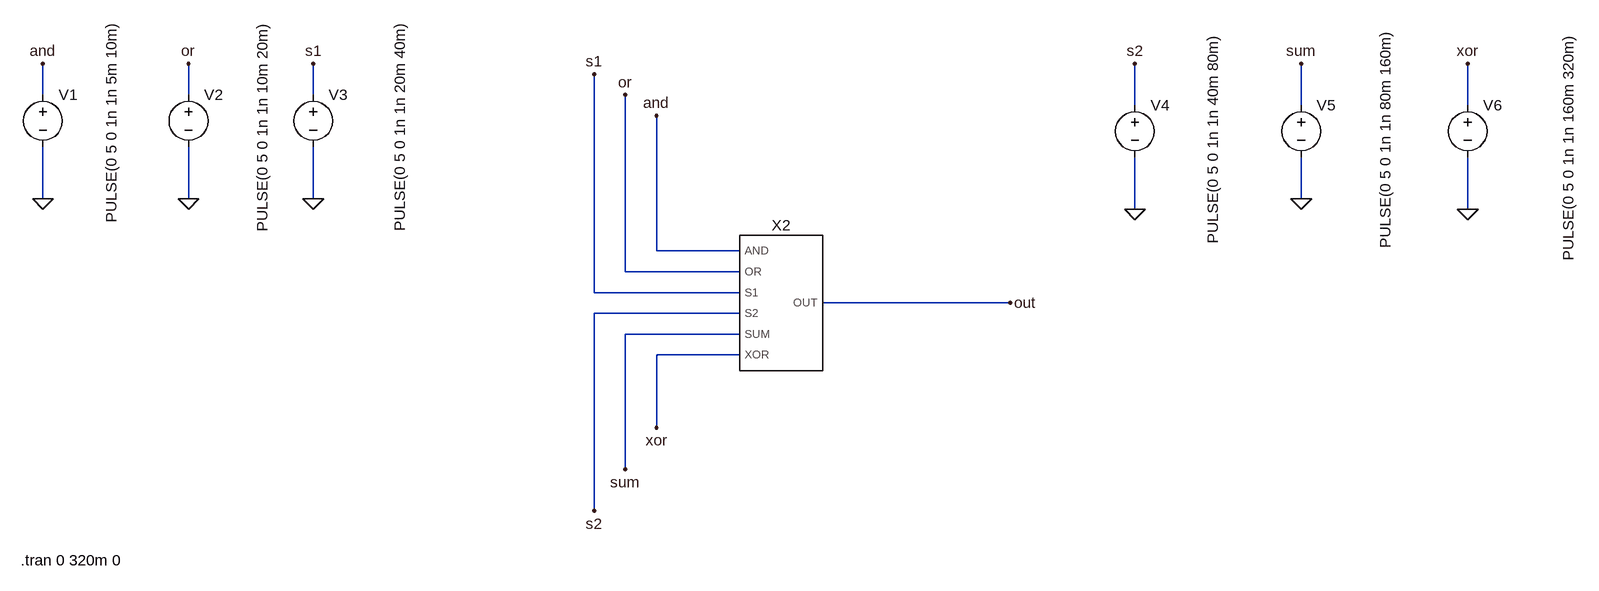
[diagram p0: schematic 4_1_mux_tb.asc]
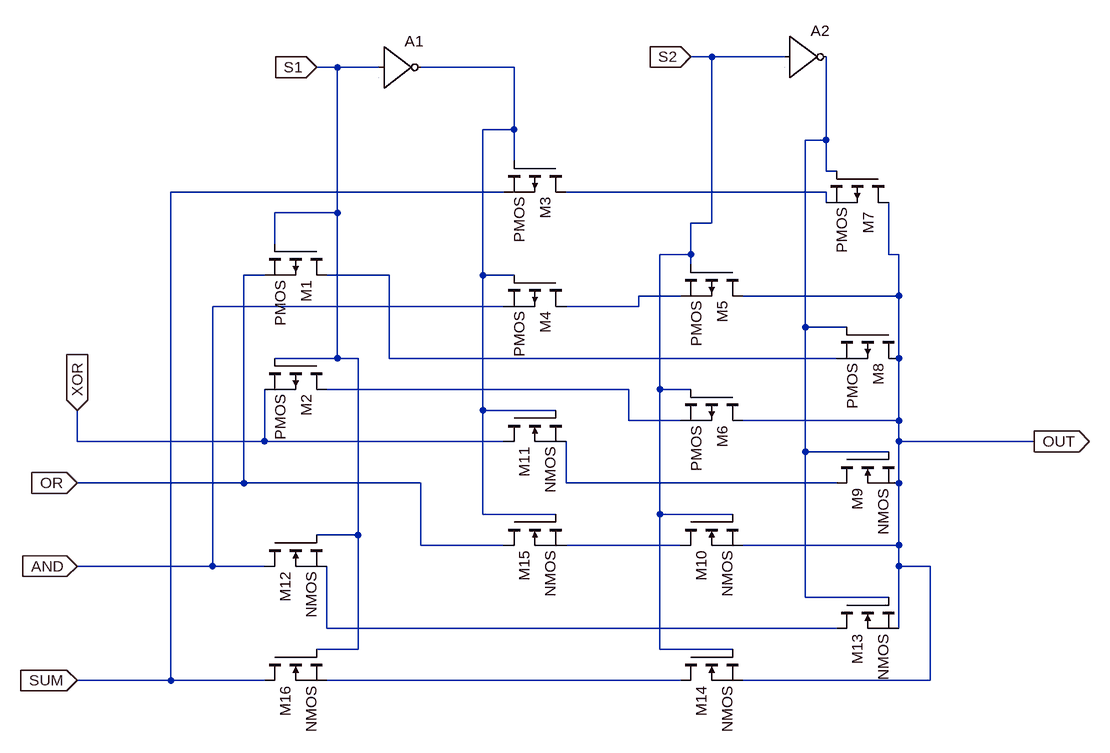
[diagram p1: sub-circuit 4_1_mux.asc]
4_1_mux_tb.asc, the LTspice schematic file:
Version 4
SHEET 1 1692 680
WIRE -912 -128 -912 -176
WIRE -688 -128 -688 -176
WIRE -496 -128 -496 -176
WIRE 768 -112 768 -176
WIRE 1024 -112 1024 -176
WIRE 1280 -112 1280 -176
WIRE -912 32 -912 -48
WIRE -688 32 -688 -48
WIRE -496 32 -496 -48
WIRE 1024 32 1024 -32
WIRE 768 48 768 -32
WIRE 1280 48 1280 -32
WIRE 32 112 32 -96
WIRE 160 112 32 112
WIRE -16 144 -16 -128
WIRE 160 144 -16 144
WIRE -64 176 -64 -160
WIRE 160 176 -64 176
WIRE 576 192 288 192
WIRE 160 208 -64 208
WIRE 160 240 -16 240
WIRE 160 272 32 272
WIRE 32 384 32 272
WIRE -16 448 -16 240
WIRE -64 512 -64 208
FLAG 32 -96 and
FLAG -912 -176 and
FLAG -16 -128 or
FLAG -688 -176 or
FLAG -64 -160 s1
FLAG -496 -176 s1
FLAG -64 512 s2
FLAG 768 -176 s2
FLAG -16 448 sum
FLAG 1024 -176 sum
FLAG 32 384 xor
FLAG 1280 -176 xor
FLAG 576 192 out
FLAG 768 48 0
FLAG 1024 32 0
FLAG 1280 48 0
FLAG -496 32 0
FLAG -688 32 0
FLAG -912 32 0
SYMBOL voltage -912 -144 R0
WINDOW 3 105 -97 VRight 2
WINDOW 123 0 0 Left 0
WINDOW 39 0 0 Left 0
SYMATTR InstName V1
SYMATTR Value PULSE(0 5 0 1n 1n 5m 10m)
SYMBOL voltage -688 -144 R0
WINDOW 3 114 -97 VRight 2
WINDOW 123 0 0 Left 0
WINDOW 39 0 0 Left 0
SYMATTR InstName V2
SYMATTR Value PULSE(0 5 0 1n 1n 10m 20m)
SYMBOL voltage -496 -144 R0
WINDOW 3 133 -98 VRight 2
WINDOW 123 0 0 Left 0
WINDOW 39 0 0 Left 0
SYMATTR InstName V3
SYMATTR Value PULSE(0 5 0 1n 1n 20m 40m)
SYMBOL voltage 768 -128 R0
WINDOW 3 120 -95 VRight 2
WINDOW 123 0 0 Left 0
WINDOW 39 0 0 Left 0
SYMATTR InstName V4
SYMATTR Value PULSE(0 5 0 1n 1n 40m 80m)
SYMBOL voltage 1024 -128 R0
WINDOW 3 129 -101 VRight 2
WINDOW 123 0 0 Left 0
WINDOW 39 0 0 Left 0
SYMATTR InstName V5
SYMATTR Value PULSE(0 5 0 1n 1n 80m 160m)
SYMBOL voltage 1280 -128 R0
WINDOW 3 155 -96 VRight 2
WINDOW 123 0 0 Left 0
WINDOW 39 0 0 Left 0
SYMATTR InstName V6
SYMATTR Value PULSE(0 5 0 1n 1n 160m 320m)
SYMBOL 4_1_mux 224 192 R0
SYMATTR InstName X2
TEXT -946 588 Left 2 !.tran 0 320m 0

4_1_mux.asc, the sub-circuit schematic file:
Version 4
SHEET 1 924 820
WIRE 320 -224 288 -224
WIRE 432 -224 320 -224
WIRE -256 -208 -288 -208
WIRE -192 -208 -256 -208
WIRE 16 -208 -128 -208
WIRE 16 -112 16 -208
WIRE 16 -112 -32 -112
WIRE 496 -96 496 -224
WIRE 496 -96 464 -96
WIRE 16 -64 16 -112
WIRE 496 -48 496 -96
WIRE 512 -48 496 -48
WIRE 0 -16 -512 -16
WIRE 496 -16 96 -16
WIRE 496 0 496 -16
WIRE -256 16 -256 -208
WIRE -256 16 -352 16
WIRE 320 32 320 -224
WIRE 320 32 288 32
WIRE -352 64 -352 16
WIRE 288 80 288 32
WIRE 288 80 240 80
WIRE 592 80 592 0
WIRE 608 80 592 80
WIRE 288 96 288 80
WIRE -368 112 -400 112
WIRE -176 112 -272 112
WIRE -32 112 -32 -112
WIRE 16 112 -32 112
WIRE 272 144 208 144
WIRE 608 144 608 80
WIRE 608 144 368 144
WIRE 0 160 -448 160
WIRE 208 160 208 144
WIRE 208 160 96 160
WIRE 464 192 464 -96
WIRE 528 192 464 192
WIRE -256 240 -256 16
WIRE -256 240 -352 240
WIRE -224 240 -256 240
WIRE -176 240 -176 112
WIRE 512 240 -176 240
WIRE 608 240 608 144
WIRE 192 288 -272 288
WIRE 240 288 240 80
WIRE 288 288 240 288
WIRE -32 320 -32 112
WIRE 80 320 -32 320
WIRE 192 336 192 288
WIRE 272 336 192 336
WIRE 608 336 608 240
WIRE 608 336 368 336
WIRE -656 368 -656 320
WIRE -368 368 -368 288
WIRE -368 368 -656 368
WIRE 0 368 -368 368
WIRE 608 368 608 336
WIRE 816 368 608 368
WIRE 464 384 464 192
WIRE 592 384 464 384
WIRE -400 432 -400 112
WIRE -400 432 -656 432
WIRE -128 432 -400 432
WIRE 96 432 96 368
WIRE 512 432 96 432
WIRE 608 432 608 368
WIRE -32 480 -32 320
WIRE 80 480 -32 480
WIRE 240 480 240 288
WIRE 352 480 240 480
WIRE -224 512 -224 240
WIRE -224 512 -288 512
WIRE -128 528 -128 432
WIRE 0 528 -128 528
WIRE 272 528 96 528
WIRE 608 528 608 432
WIRE 608 528 368 528
WIRE -448 560 -448 160
WIRE -448 560 -656 560
WIRE -368 560 -448 560
WIRE 608 560 608 528
WIRE 656 560 608 560
WIRE 464 608 464 384
WIRE 592 608 464 608
WIRE -272 656 -272 560
WIRE 512 656 -272 656
WIRE 608 656 608 560
WIRE -224 688 -224 512
WIRE -224 688 -288 688
WIRE 240 688 240 480
WIRE 352 688 240 688
WIRE -512 736 -512 -16
WIRE -512 736 -656 736
WIRE -368 736 -512 736
WIRE 272 736 -272 736
WIRE 656 736 656 560
WIRE 656 736 368 736
FLAG -656 736 SUM
IOPIN -656 736 In
FLAG -656 560 AND
IOPIN -656 560 In
FLAG -656 432 OR
IOPIN -656 432 In
FLAG -656 320 XOR
IOPIN -656 320 In
FLAG 816 368 OUT
IOPIN 816 368 Out
FLAG -288 -208 S1
IOPIN -288 -208 In
FLAG 288 -224 S2
IOPIN 288 -224 In
SYMBOL pmos -272 64 R90
SYMATTR InstName M1
SYMBOL pmos -272 240 R90
SYMATTR InstName M2
SYMBOL pmos 96 -64 R90
SYMATTR InstName M3
SYMBOL pmos 96 112 R90
SYMATTR InstName M4
SYMBOL pmos 368 96 R90
SYMATTR InstName M5
SYMBOL pmos 368 288 R90
SYMATTR InstName M6
SYMBOL pmos 592 -48 R90
WINDOW 0 63 31 Left 2
SYMATTR InstName M7
SYMBOL pmos 608 192 R90
SYMATTR InstName M8
SYMBOL nmos 512 384 M90
SYMATTR InstName M9
SYMBOL nmos 272 480 M90
SYMATTR InstName M10
SYMBOL nmos 0 320 M90
SYMATTR InstName M11
SYMBOL nmos -368 512 M90
SYMATTR InstName M12
SYMBOL nmos 512 608 M90
SYMATTR InstName M13
SYMBOL nmos 272 688 M90
SYMATTR InstName M14
SYMBOL nmos 0 480 M90
SYMATTR InstName M15
SYMBOL nmos -368 688 M90
SYMATTR InstName M16
SYMBOL Digital\\inv -192 -272 R0
SYMATTR InstName A1
SYMBOL Digital\\inv 432 -288 R0
SYMATTR InstName A2

The netlist it stands for:
* 4_1_mux_tb.asc
V1 and 0 PULSE(0 5 0 1n 1n 5m 10m)
V2 or 0 PULSE(0 5 0 1n 1n 10m 20m)
V3 s1 0 PULSE(0 5 0 1n 1n 20m 40m)
V4 s2 0 PULSE(0 5 0 1n 1n 40m 80m)
V5 sum 0 PULSE(0 5 0 1n 1n 80m 160m)
V6 xor 0 PULSE(0 5 0 1n 1n 160m 320m)
XX2 and or s1 s2 sum xor out 4_1_mux

* block symbol definitions
.subckt 4_1_mux AND OR S1 S2 SUM XOR OUT
M1 N004 S1 OR OR PMOS
M2 N006 S1 XOR XOR PMOS
M3 N003 N001 SUM SUM PMOS
M4 N005 N001 AND AND PMOS
M5 OUT S2 N005 N005 PMOS
M6 OUT S2 N006 N006 PMOS
M7 OUT N002 N003 N003 PMOS
M8 OUT N002 N004 N004 PMOS
M9 N007 N002 OUT OUT NMOS
M10 N008 S2 OUT OUT NMOS
M11 XOR N001 N007 N007 NMOS
M12 AND S1 N009 N009 NMOS
M13 N009 N002 OUT OUT NMOS
M14 N010 S2 OUT OUT NMOS
M15 OR N001 N008 N008 NMOS
M16 SUM S1 N010 N010 NMOS
A1 S1 0 0 0 0 N001 0 0 BUF
A2 S2 0 0 0 0 N002 0 0 BUF
.ends 4_1_mux

.model NMOS NMOS
.model PMOS PMOS
.lib standard.mos
.tran 0 320m 0
.backanno
.end

* Results of the author's LTspice run, read from the files saved beside the schematic
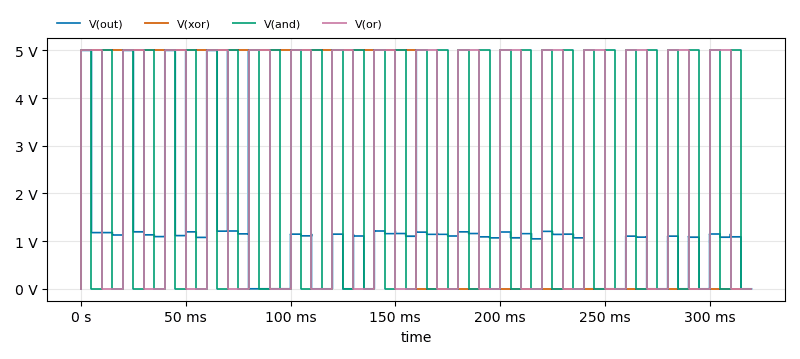
[diagram p2: Transient Analysis of 4_1_mux_tb.asc, plotted from the saved traces]
* Transient Analysis, 1 run:
*   V(out): min 0 V, max 5 V, average 1.075 V, rms 1.559 V, last 0 V
*   V(xor): min 0 V, max 5 V, average 2.5 V, rms 3.536 V, last 0 V
*   V(and): min 0 V, max 5 V, average 2.5 V, rms 3.536 V, last 0 V
*   V(or): min 0 V, max 5 V, average 2.5 V, rms 3.536 V, last 0 V